# EAGLE design 4channelsRelayv2 (EAGLE 6.1)
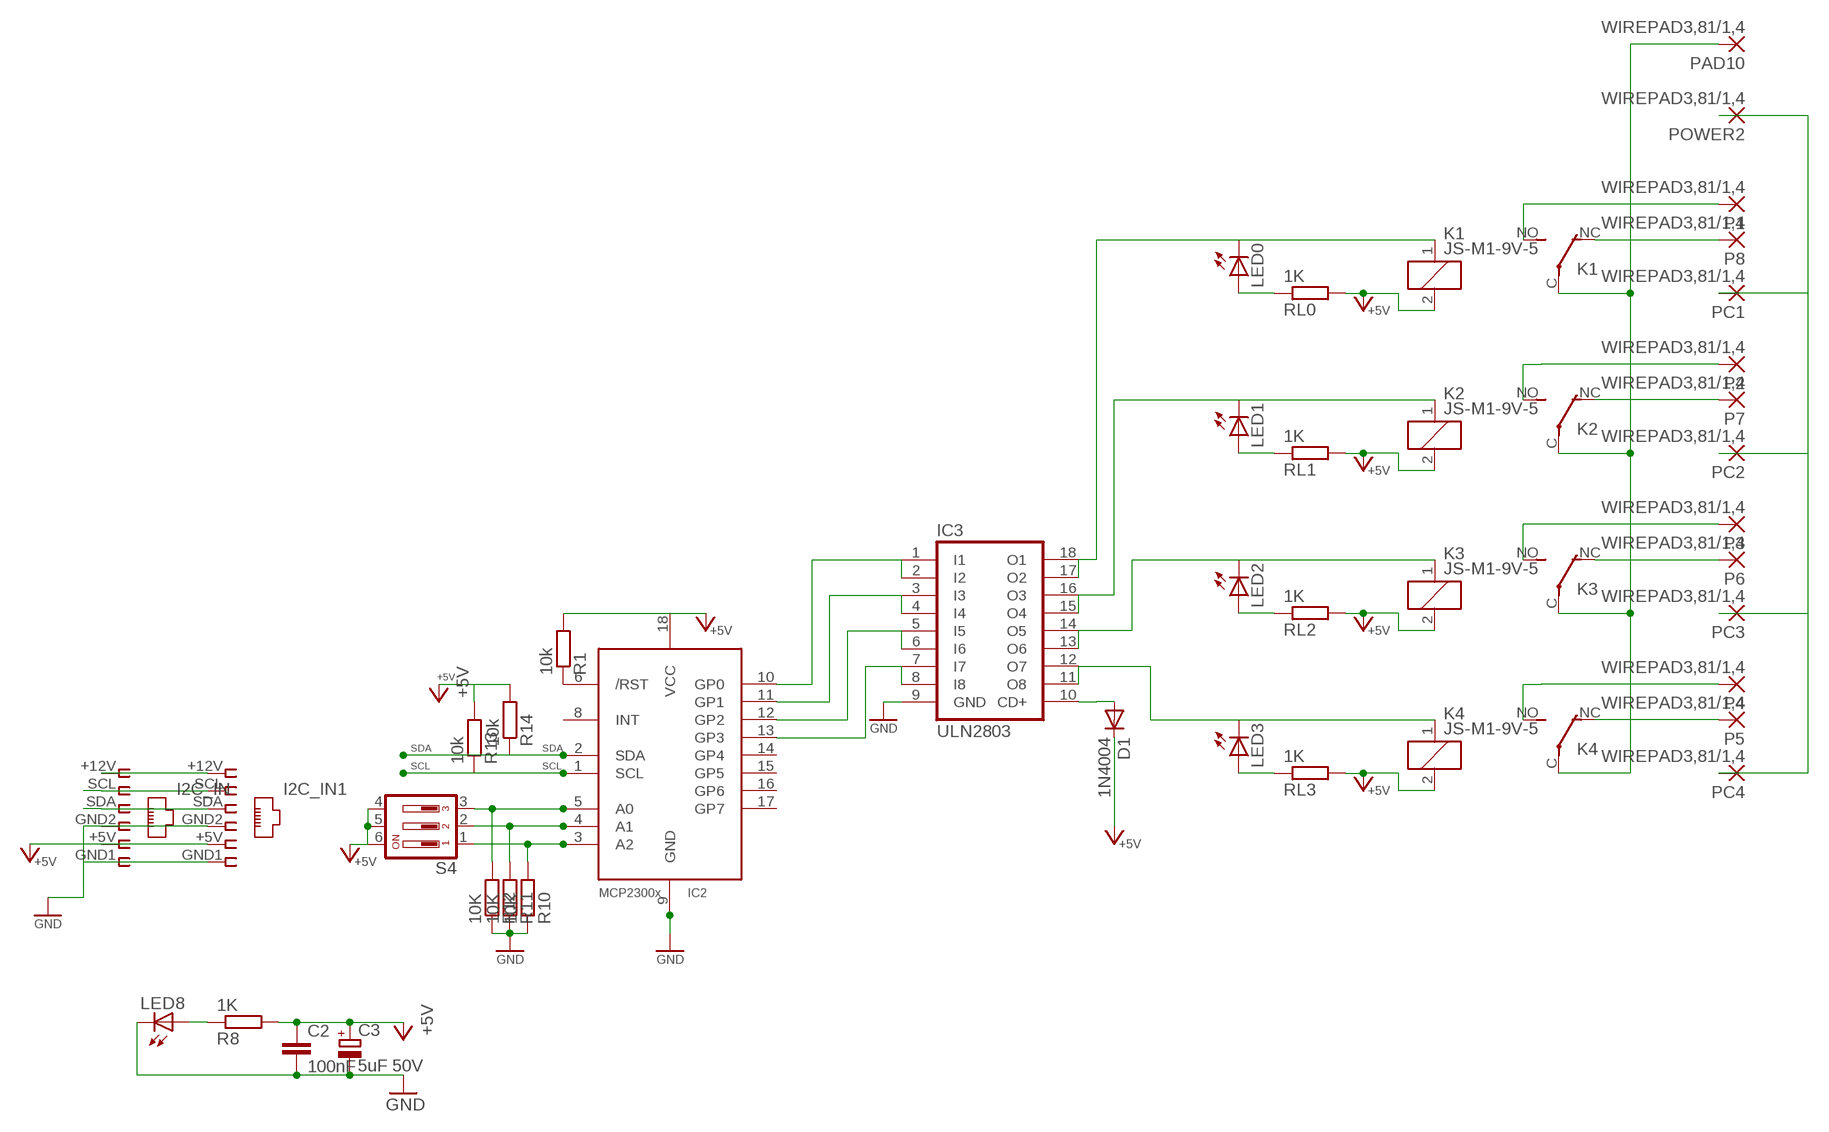
[diagram p0: schematic, sheet 1]

## Parts
C2  100nF  C-EUC1206  [C1206]
C3  5uF 50V  CPOL-EUE3.5-8  [E3,5-8]
D1  1N4004  [DO41-10]
I2C_IN  I2C 1  RJ12STRAIGHT-I2C  [RJ12-STRAIGHT-I2C]
I2C_IN1  I2C 2  RJ12STRAIGHT-I2C  [RJ12-STRAIGHT-I2C]
IC2  MCP2300X/P  [DIL18]
IC3  ULN2803  ULN2803A  [DIL18]
K1  JS-M1-9V-5  [JS-M]
K2  JS-M1-9V-5  [JS-M]
K3  JS-M1-9V-5  [JS-M]
K4  JS-M1-9V-5  [JS-M]
LED0  LED3MM  [LED3MM]
LED1  LED3MM  [LED3MM]
LED2  LED3MM  [LED3MM]
LED3  LED3MM  [LED3MM]
LED8  LED3MM  [LED3MM]
P1  WIREPAD3,81/1,4  [3,81/1,4]
P2  WIREPAD3,81/1,4  [3,81/1,4]
P3  WIREPAD3,81/1,4  [3,81/1,4]
P4  WIREPAD3,81/1,4  [3,81/1,4]
P5  WIREPAD3,81/1,4  [3,81/1,4]
P6  WIREPAD3,81/1,4  [3,81/1,4]
P7  WIREPAD3,81/1,4  [3,81/1,4]
P8  WIREPAD3,81/1,4  [3,81/1,4]
PAD10  WIREPAD3,81/1,4  [3,81/1,4]
PC1  WIREPAD3,81/1,4  [3,81/1,4]
PC2  WIREPAD3,81/1,4  [3,81/1,4]
PC3  WIREPAD3,81/1,4  [3,81/1,4]
PC4  WIREPAD3,81/1,4  [3,81/1,4]
POWER2  WIREPAD3,81/1,4  [3,81/1,4]
R1  10k  R-EU_M1206  [M1206]
R8  1K  R-EU_M1206  [M1206]
R10  10K  R-EU_M1206  [M1206]
R11  10K  R-EU_M1206  [M1206]
R12  10K  R-EU_M1206  [M1206]
R13  10k  R-EU_M1206  [M1206]
R14  10k  R-EU_M1206  [M1206]
RL0  1K  R-EU_M1206  [M1206]
RL1  1K  R-EU_M1206  [M1206]
RL2  1K  R-EU_M1206  [M1206]
RL3  1K  R-EU_M1206  [M1206]
S4  DIP03YL  [DIP03YL]

## Nets
+5V [highpower]: C2.1 C3.+ D1.C I2C_IN1.+5V I2C_IN.+5V IC2.18(VCC) K1.2 K2.2 K3.2 K4.2 R1.2 R8.2 R13.2 R14.2 RL0.2 RL1.2 RL2.2 RL3.2 S4.4 S4.5 S4.6
CD+: D1.A IC3.10(CD+)
GND [highpower]: C2.2 C3.- I2C_IN1.GND1 I2C_IN1.GND2 I2C_IN.GND1 I2C_IN.GND2 IC2.9(GND) IC3.9(GND) LED8.K(C) R10.1 R11.1 R12.1
N$1 [power]: IC3.15(O4) IC3.16(O3) K2.1 LED1.K(C)
N$2: LED0.A RL0.1
N$3 [power]: IC3.17(O2) IC3.18(O1) K1.1 LED0.K(C)
N$4: LED1.A RL1.1
N$5 [highpower]: I2C_IN1.+12V I2C_IN.+12V
N$6 [highpower]: K1.NC(2:O) P8.1(P)
N$7 [highpower]: K2.NC(2:O) P7.1(P)
N$8 [highpower]: K4.NO(2:S) P4.1(P)
N$9 [power]: IC3.11(O8) IC3.12(O7) K4.1 LED3.K(C)
N$10 [highpower]: K3.NC(2:O) P6.1(P)
N$11 [highpower]: K3.NO(2:S) P3.1(P)
N$12 [highpower]: PC1.1(P) PC2.1(P) PC3.1(P) PC4.1(P) POWER2.1(P)
N$13 [highpower]: K4.NC(2:O) P5.1(P)
N$14 [highpower]: K2.NO(2:S) P2.1(P)
N$15: IC2.6(/RST) R1.1
N$16: IC2.5(A0) R12.2 S4.3
N$17: IC2.4(A1) R11.2 S4.2
N$18: IC2.3(A2) R10.2 S4.1
N$19 [highpower]: K1.NO(2:S) P1.1(P)
N$23: LED8.A R8.1
N$38: LED2.A RL2.1
N$40 [power]: IC3.13(O6) IC3.14(O5) K3.1 LED2.K(C)
N$41: LED3.A RL3.1
P0: IC2.10(GP0) IC3.1(I1) IC3.2(I2)
P1: IC2.11(GP1) IC3.3(I3) IC3.4(I4)
P2: IC2.12(GP2) IC3.5(I5) IC3.6(I6)
P3: IC2.13(GP3) IC3.7(I7) IC3.8(I8)
POWER1 [highpower]: K1.C(2:P) K2.C(2:P) K3.C(2:P) K4.C(2:P) PAD10.1(P)
SCL: I2C_IN1.SCL I2C_IN.SCL IC2.1(SCL) R13.1
SDA: I2C_IN1.SDA I2C_IN.SDA IC2.2(SDA) R14.1
Unconnected: IC2.8(INT) IC2.14(GP4) IC2.15(GP5) IC2.16(GP6) IC2.17(GP7)

## Library data of the parts
C2 = rcl:C-EU: CAPACITOR, European symbol
C3 = rcl:CPOL-EU: POLARIZED CAPACITOR, European symbol
D1 = diode:1N4004: DIODE general purpose rectifier, 1 A
I2C_IN I2C_IN1 = lpatiny:RJ12: CORCOM Modular RJ Jacks No Shield Source: www.tycoelectronics.com .. ENG_DS_1654001_1099_RJ_L_0507.pdf
IC2 = adafruit:MCP2300X: MCP23008 Inexpensive i2c i/o expander - 8 general purpose i/o pins with optional pullups
IC3 = uln-udn:ULN2803A: DRIVER ARRAY
K1-K4 = relay:JS-M1*: Automotive Ultra-Miniature Power Relay NAiS Source: http://www.mew-europe.com/.. en_ds_61211_0000.pdf; OC_FARNELL: unknown; OC_NEWARK: unknown
LED0 LED1-LED3 LED8 = lpatiny:LED3MM
P1-P8 PAD10 PC1-PC4 POWER2 = wirepad:WIREPAD: Wire PAD connect wire on PCB
R1 R8 R10-R14 RL0 RL1-RL3 = resistor:R-EU_: RESISTOR, European symbol
S4 = switch-dil:DIP03YL: DIL/CODE SWITCH; OC_FARNELL: unknown; OC_NEWARK: unknown

## Net classes
0 default: width 0.457 mm
1 power: width 0.914 mm
2 highpower: width 1.372 mm

## Board
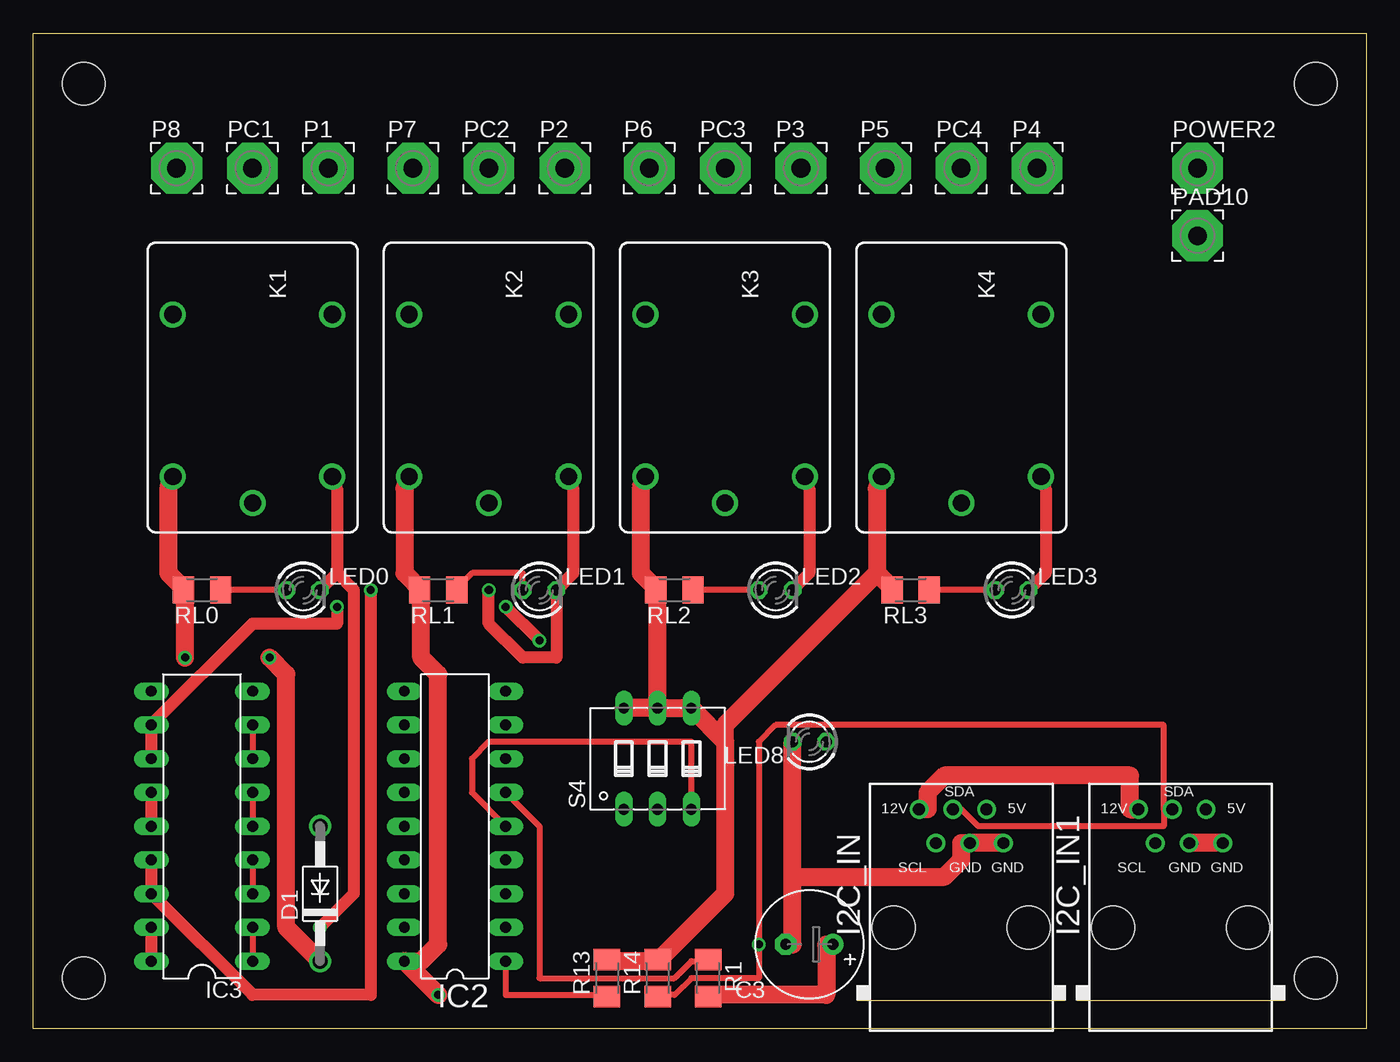
[diagram p1: board, top side]
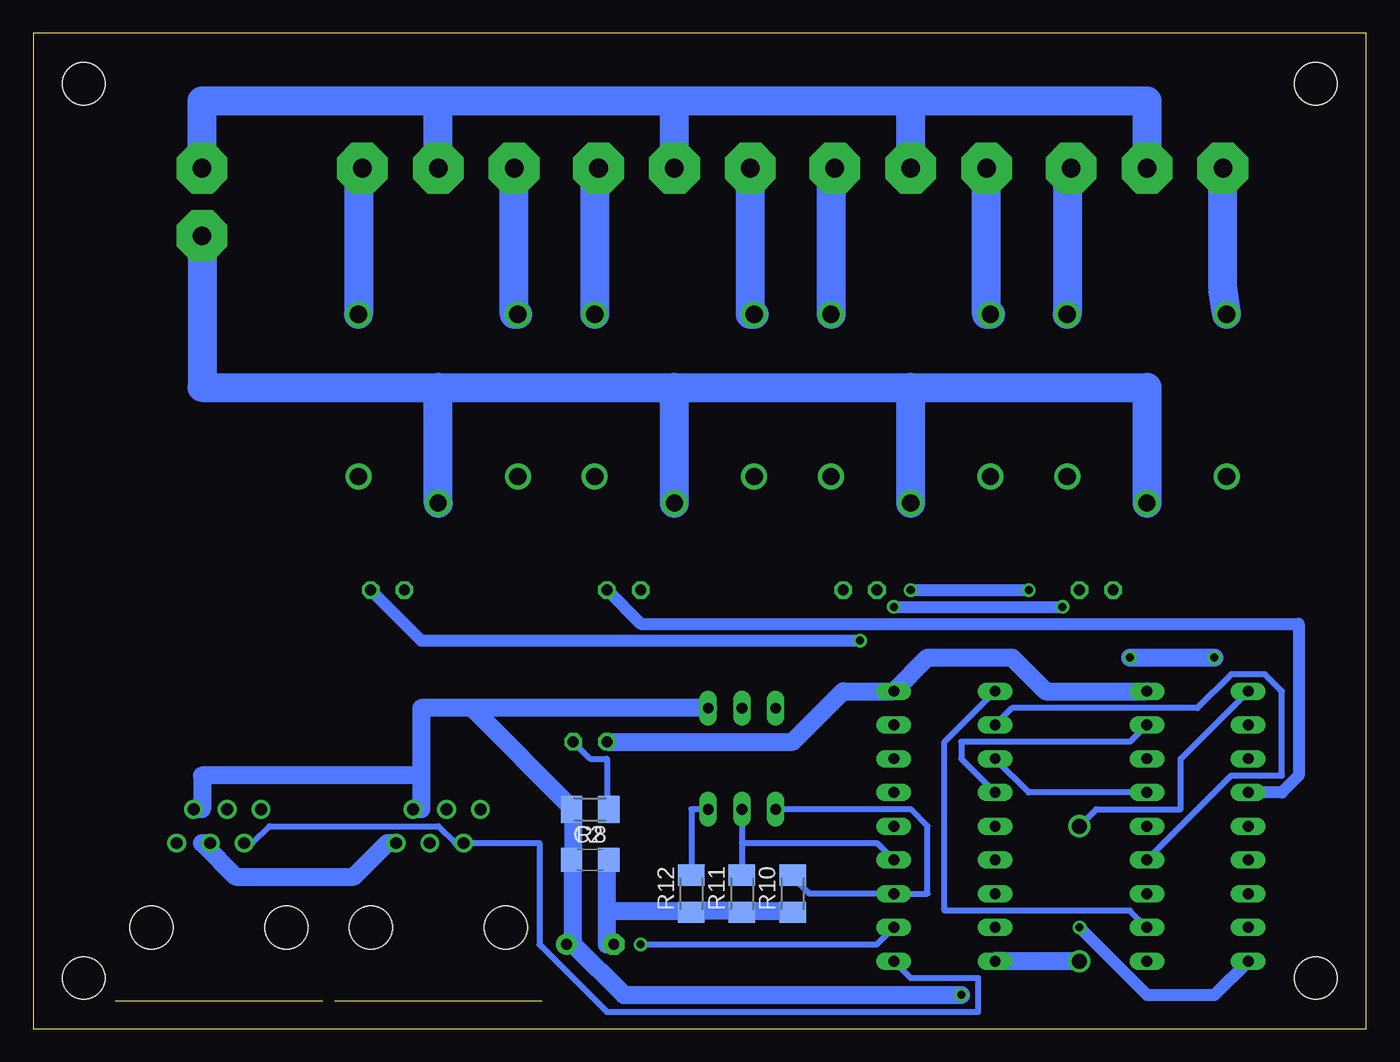
[diagram p2: board, bottom side, seen from below]

Size 100.33 x 74.93 mm. Coordinates in mm from the lower left corner, seen from the top.
Outline: 0,74.93 100.33,74.93 100.33,0 0,0 0,74.93
Copper layers (1*16): Top 0.035mm / dielectric 1.5mm / Bottom 0.035mm
Design rules: minimum track width 10mil, minimum drill 24mil, track to track 8mil, track to pad 8mil, pad to pad 8mil, via to via 8mil, smd to smd 8mil, copper to edge 40mil, drill to drill 8mil, minimum pad ring 10mil, minimum via ring 8mil, stop-mask expansion 4mil, vias tented up to drill 0mil, thermal gap 10mil
Holes 3.2 mm at 3.81,71.12 3.81,3.81 96.52,3.81 96.52,71.12
tRestrict: area -5.1,41.9 to 86.4,49.5; area 30.5,35.6 to 38.1,43.2; area 48.3,35.6 to 55.9,43.2; area 66,35.6 to 73.7,43.2; area 12.7,35.6 to 20.3,43.2
bRestrict: area -5.1,41.9 to 86.4,49.5; area 12.7,35.6 to 20.3,43.2; area 30.5,35.6 to 38.1,43.2; area 48.3,35.6 to 55.9,43.2; area 66,35.6 to 73.7,43.2
Milling: 4 lines

### Footprints (pad centres in the part's own frame; a part is rotated, then mirrored left to right if it is on the bottom)
C1206 = smd 1.6 x 1.8: 1 -1.4,0; 2 1.4,0
E3,5-8 = drill 0.813 pad 1.6: + -1.778,0 | drill 0.813 pad 1.6 octagon: - 1.778,0
DO41-10 = drill 1.118: A 5.08,0; C -5.08,0
RJ12-STRAIGHT-I2C = drill 0.9 pad 1.4: +5V 1.905,8.89; +12V -3.175,8.89; GND1 3.175,6.35; GND2 0.635,6.35; SCL -1.905,6.35; SDA -0.635,8.89 | hole 3.251: -5.08,0; 5.08,0
DIL18 = drill 0.813 long: 1 -10.16,-3.81; 2 -7.62,-3.81; 3 -5.08,-3.81; 4 -2.54,-3.81; 5 0,-3.81; 6 2.54,-3.81; 7 5.08,-3.81; 8 7.62,-3.81; 9 10.16,-3.81; 10 10.16,3.81; 11 7.62,3.81; 12 5.08,3.81; 13 2.54,3.81; 14 0,3.81; 15 -2.54,3.81; 16 -5.08,3.81; 17 -7.62,3.81; 18 -10.16,3.81
JS-M = drill 1.3: 1 6.7,6; 2 6.7,-6; C 8.7,0; NC -5.5,-6; NO -5.5,6
LED3MM = drill 0.813 octagon: A -1.27,0; K 1.27,0
3,81/1,4 = drill 1.397 pad 3.81 octagon: 1 0,0
M1206 = smd 1.6 x 2: 1 -1.4,0; 2 1.4,0
DIP03YL = drill 0.813 long: 1 -2.54,-3.81; 2 0,-3.81; 3 2.54,-3.81; 4 2.54,3.81; 5 0,3.81; 6 -2.54,3.81

### Placement (x,y rotation side)
C2  58.42,12.7 0 bottom
C3  58.42,6.35 180 top
D1  21.59,10.16 90 top
I2C_IN  69.85,7.62 0 top
I2C_IN1  86.36,7.62 0 top
IC2  31.75,15.24 90 top
IC3  12.7,15.24 90 top
K1  16.51,48.26 270 top
K2  34.29,48.26 270 top
K3  52.07,48.26 270 top
K4  69.85,48.26 270 top
LED0  20.32,33.02 0 top
LED1  38.1,33.02 0 top
LED2  55.88,33.02 0 top
LED3  73.66,33.02 0 top
LED8  58.42,21.59 180 top
P1  22.23,64.77 0 top
P2  40.01,64.77 0 top
P3  57.78,64.77 0 top
P4  75.56,64.77 0 top
P5  64.14,64.77 0 top
P6  46.35,64.77 0 top
P7  28.57,64.77 0 top
P8  10.79,64.77 0 top
PAD10  87.63,59.69 0 top
PC1  16.51,64.77 0 top
PC2  34.29,64.77 0 top
PC3  52.07,64.77 0 top
PC4  69.85,64.77 0 top
POWER2  87.63,64.77 0 top
R1  50.8,3.81 270 top
R8  58.42,16.51 180 bottom
R10  43.18,10.16 90 bottom
R11  46.99,10.16 90 bottom
R12  50.8,10.16 90 bottom
R13  43.18,3.81 90 top
R14  46.99,3.81 90 top
RL0  12.7,33.02 180 top
RL1  30.48,33.02 180 top
RL2  48.26,33.02 180 top
RL3  66.04,33.02 180 top
S4  46.99,20.32 0 top

### Tracks (layer width: path | path; a pad name or v marks a point on that pad's centre or on a via)
+5V  (via drill 0.61)
  Top 1.372: 29.21,33.02 27.94,34.29 27.94,40.64 K2.2 | 11.43,33.02 10.16,34.29 10.16,40.64 K1.2 | v11.43,27.94 11.43,33.02 | v17.78,27.94 19.05,26.67 19.05,7.62 D1.C | 11.43,33.02 RL0.2 | 29.21,33.02 29.21,27.94 30.48,26.67 30.48,6.35 29.21,5.08 IC2.18 v30.48,2.54 | 29.21,33.02 RL1.2 | R1.2 50.8,2.54 59.69,2.54 59.69,6.35 C3.+ | 63.5,34.29 64.77,33.02 RL3.2 | 63.5,34.29 63.5,40.64 K4.2 | 46.99,33.02 45.72,34.29 45.72,40.64 K3.2 | 46.99,5.08 43.18,5.08 R13.2 | S4.5 S4.6 | S4.5 S4.4 52.07,21.59 | 46.99,5.08 52.07,10.16 52.07,21.59 | 46.99,5.08 R14.2 | S4.5 46.99,33.02 | 46.99,33.02 RL2.2 | 63.5,34.29 52.07,22.86 52.07,21.59
  Bottom 1.372: D1.C IC2.18 | v17.78,27.94 v11.43,27.94 | 59.69,16.51 59.69,12.7 | 59.69,6.35 59.69,12.7 | 59.69,12.7 C2.1 | 71.12,19.05 71.12,24.13 67.31,24.13 | 71.12,19.05 71.12,16.51 I2C_IN.+5V | S4.4 67.31,24.13 | 71.12,19.05 87.63,19.05 87.63,16.51 I2C_IN1.+5V | 67.31,24.13 59.69,16.51 | 59.69,16.51 R8.2 | v30.48,2.54 55.88,2.54 59.69,6.35 | 59.69,6.35 C3.+
CD+
  Bottom 0.457: IC3.10 13.97,20.32 13.97,16.51 20.32,16.51 D1.A
GND
  Top 1.372: I2C_IN.GND1 I2C_IN.GND2 69.85,13.97 69.85,12.7 68.58,11.43 57.15,11.43 | I2C_IN1.GND1 I2C_IN1.GND2 | 57.15,11.43 57.15,6.35 C3.- | 57.15,11.43 LED8.K
  Bottom 1.372: I2C_IN.GND1 73.66,13.97 76.2,11.43 85.09,11.43 87.63,13.97 I2C_IN1.GND2 | IC3.9 24.13,25.4 26.67,27.94 33.02,27.94 IC2.9 39.37,25.4 43.18,21.59 LED8.K | 46.99,8.89 43.18,8.89 R10.1 | 46.99,8.89 50.8,8.89 | 46.99,8.89 R11.1 | 57.15,8.89 57.15,6.35 C3.- | 57.15,8.89 57.15,12.7 C2.2 | 57.15,8.89 50.8,8.89 | 50.8,8.89 R12.1
N$1  (via drill 0.61)
  Top 0.914: IC3.15 IC3.16 16.51,2.54 25.4,2.54 v25.4,33.02 | K2.1 40.64,40.64 40.64,34.29 LED1.K 39.37,27.94 36.83,27.94 34.29,30.48 v34.29,33.02
  Bottom 0.914: v34.29,33.02 v25.4,33.02
N$2
  Top 0.457: LED0.A RL0.1 13.97,33.02
N$3  (via drill 0.61)
  Top 0.914: IC3.17 IC3.18 | 22.86,34.29 LED0.K | 22.86,34.29 22.86,40.64 K1.1 | v21.59,7.62 24.13,10.16 24.13,33.02 22.86,34.29
  Bottom 0.914: IC3.18 11.43,2.54 16.51,2.54 v21.59,7.62
N$4
  Top 0.457: LED1.A 36.83,34.29 33.02,34.29 31.75,33.02 RL1.1
N$5
  Top 1.372: I2C_IN.+12V 67.31,16.51 67.31,17.78 68.58,19.05 82.55,19.05 82.55,16.51 I2C_IN1.+12V
N$6
  Bottom 2.184: K1.NC 10.79,55.66 P8.1
N$7
  Bottom 2.184: K2.NC 28.57,53.76 P7.1
N$8
  Bottom 2.184: P4.1 75.85,64.77 K4.NO
N$9  (via drill 0.61)
  Top 0.914: IC3.12 IC3.11 16.51,30.48 22.86,30.48 v22.86,31.75 | LED3.K 76.2,34.29 76.2,40.64 K4.1 | v38.1,29.21 v35.56,31.75
  Bottom 0.914: v35.56,31.75 v22.86,31.75 | v38.1,29.21 71.12,29.21 LED3.K
N$10
  Bottom 2.184: K3.NC 46.35,53.76 P6.1
N$11
  Bottom 2.184: P3.1 58.07,64.77 K3.NO
N$12
  Bottom 2.184: POWER2.1 87.63,69.85 69.85,69.85 | PC4.1 69.85,69.85 | 69.85,69.85 52.07,69.85 | PC3.1 52.07,69.85 | 52.07,69.85 34.29,69.85 | PC2.1 34.29,69.85 | 34.29,69.85 16.51,69.85 PC1.1
N$13
  Bottom 2.184: K4.NC 64.14,53.76 P5.1
N$14
  Bottom 2.184: P2.1 40.29,64.77 K2.NO
N$15
  Top 0.457: IC2.6 38.1,15.24 38.1,3.81 48.26,3.81 49.53,5.08 50.8,5.08 R1.1
N$16
  Top 0.457: IC2.5 33.02,17.78 33.02,20.32 34.29,21.59 49.53,21.59 S4.3
  Bottom 0.457: S4.3 50.8,16.51 R12.2 50.8,11.43
N$17
  Bottom 0.457: S4.2 46.99,13.97 | 46.99,13.97 R11.2 46.99,11.43 | IC2.4 36.83,13.97 46.99,13.97
N$18
  Bottom 0.457: R10.2 43.18,11.43 41.91,10.16 IC2.3 33.02,10.16 33.02,15.24 34.29,16.51 S4.1
N$19
  Bottom 2.184: P1.1 22.51,64.77 K1.NO
N$23
  Bottom 0.457: LED8.A 58.42,20.32 57.15,20.32 57.15,16.51 R8.1
N$38
  Top 0.457: LED2.A RL2.1 49.53,33.02
N$40
  Top 0.914: IC3.13 IC3.14 | LED2.K 58.42,34.29 58.42,40.64 K3.1
  Bottom 0.914: IC3.13 6.35,17.78 5.08,19.05 5.08,30.48 54.61,30.48 LED2.K
N$41
  Top 0.457: LED3.A RL3.1 67.31,33.02
P0
  Top 0.457: IC3.2 IC3.1
  Bottom 0.457: IC2.10 31.75,21.59 31.75,8.89 17.78,8.89 IC3.2
P1
  Top 0.457: IC3.4 IC3.3
  Bottom 0.457: IC2.11 26.67,24.13 12.7,24.13 10.16,26.67 7.62,26.67 6.35,25.4 6.35,19.05 10.16,19.05 IC3.4
P2
  Top 0.457: IC3.6 IC3.5
  Bottom 0.457: IC2.12 25.4,17.78 IC3.6
P3
  Top 0.457: IC3.8 IC3.7
  Bottom 0.457: IC2.13 30.48,20.32 30.48,21.59 17.78,21.59 IC3.8
POWER1
  Bottom 2.184: PAD10.1 87.63,48.26 69.85,48.26 | K4.C 69.85,48.26 | 69.85,48.26 52.07,48.26 | K3.C 52.07,48.26 | 52.07,48.26 34.29,48.26 | K2.C 34.29,48.26 | 34.29,48.26 16.51,48.26 K1.C
SCL
  Top 0.457: IC2.1 35.56,2.54 43.18,2.54 R13.1
  Bottom 0.457: I2C_IN1.SCL 83.82,13.97 82.55,15.24 69.85,15.24 68.58,13.97 I2C_IN.SCL 62.23,13.97 62.23,6.35 57.15,1.27 29.21,1.27 29.21,3.81 34.29,3.81 IC2.1
SDA  (via drill 0.61)
  Top 0.457: 85.09,16.51 85.09,22.86 55.88,22.86 54.61,21.59 v54.61,6.35 54.61,3.81 49.53,3.81 48.26,2.54 46.99,2.54 R14.1 | 85.09,16.51 85.09,15.24 71.12,15.24 69.85,16.51 I2C_IN.SDA | 85.09,16.51 I2C_IN1.SDA
  Bottom 0.457: IC2.2 36.83,6.35 v54.61,6.35